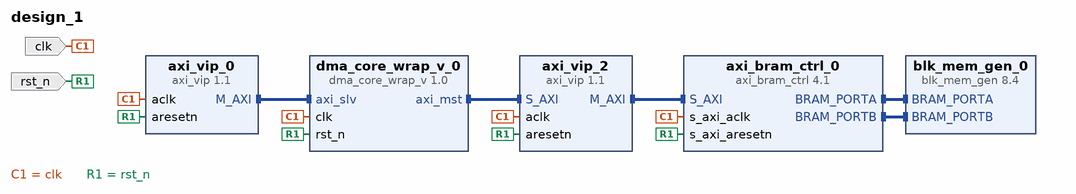
[diagram p0: block diagram of the top level]
# Vivado block design design_1, xczu19eg-ffvc1760-2-i, Vivado 2024.2
create_bd_design design_1

create_bd_port -dir I clk
create_bd_port -dir I rst_n

create_bd_cell -type ip -vlnv xilinx.com:ip:axi_vip:1.1 axi_vip_0
set_property -dict [list \
  CONFIG.ADDR_WIDTH 64 \
  CONFIG.ARUSER_WIDTH 0 \
  CONFIG.AWUSER_WIDTH 0 \
  CONFIG.BUSER_WIDTH 0 \
  CONFIG.DATA_WIDTH 64 \
  CONFIG.HAS_BRESP 1 \
  CONFIG.HAS_BURST 1 \
  CONFIG.HAS_CACHE 1 \
  CONFIG.HAS_LOCK 1 \
  CONFIG.HAS_PROT 1 \
  CONFIG.HAS_QOS 1 \
  CONFIG.HAS_REGION 1 \
  CONFIG.HAS_RRESP 1 \
  CONFIG.HAS_WSTRB 1 \
  CONFIG.ID_WIDTH 1 \
  CONFIG.INTERFACE_MODE MASTER \
  CONFIG.PROTOCOL AXI4 \
  CONFIG.READ_WRITE_MODE READ_WRITE \
  CONFIG.RUSER_WIDTH 0 \
  CONFIG.SUPPORTS_NARROW 1 \
  CONFIG.WUSER_WIDTH 0 \
] [get_bd_cells axi_vip_0]
create_bd_cell -type ip -vlnv user.org:user:dma_core_wrap_v:1.0 dma_core_wrap_v_0
set_property -dict [list \
  CONFIG.AxiIdWidth 0x00000008 \
  CONFIG.AxiSlvIdWidth 0x00000008 \
  CONFIG.FREQ_HZ 100000000 \
  CONFIG.JobFifoDepth 0x00000008 \
] [get_bd_cells dma_core_wrap_v_0]
create_bd_cell -type ip -vlnv xilinx.com:ip:axi_bram_ctrl:4.1 axi_bram_ctrl_0
set_property -dict {CONFIG.DATA_WIDTH 64} [get_bd_cells axi_bram_ctrl_0]
create_bd_cell -type ip -vlnv xilinx.com:ip:blk_mem_gen:8.4 blk_mem_gen_0
set_property -dict {CONFIG.Memory_Type True_Dual_Port_RAM} [get_bd_cells blk_mem_gen_0]
create_bd_cell -type ip -vlnv xilinx.com:ip:axi_vip:1.1 axi_vip_2

# ---- connections ----

connect_bd_intf_net [get_bd_intf_pins axi_bram_ctrl_0/BRAM_PORTA] [get_bd_intf_pins blk_mem_gen_0/BRAM_PORTA]
connect_bd_intf_net [get_bd_intf_pins axi_bram_ctrl_0/BRAM_PORTB] [get_bd_intf_pins blk_mem_gen_0/BRAM_PORTB]
connect_bd_intf_net [get_bd_intf_pins axi_vip_0/M_AXI] [get_bd_intf_pins dma_core_wrap_v_0/axi_slv]
connect_bd_intf_net [get_bd_intf_pins axi_vip_2/M_AXI] [get_bd_intf_pins axi_bram_ctrl_0/S_AXI]
connect_bd_intf_net [get_bd_intf_pins dma_core_wrap_v_0/axi_mst] [get_bd_intf_pins axi_vip_2/S_AXI]
connect_bd_net [get_bd_ports clk] \
  [get_bd_pins axi_vip_0/aclk] [get_bd_pins axi_vip_2/aclk] [get_bd_pins axi_bram_ctrl_0/s_axi_aclk] \
  [get_bd_pins dma_core_wrap_v_0/clk]
connect_bd_net [get_bd_ports rst_n] \
  [get_bd_pins axi_vip_0/aresetn] [get_bd_pins axi_vip_2/aresetn] [get_bd_pins axi_bram_ctrl_0/s_axi_aresetn] \
  [get_bd_pins dma_core_wrap_v_0/rst_n]

# ---- address map ----
assign_bd_address -offset 0x0000000044A00000 -range 64K -target_address_space [get_bd_addr_spaces axi_vip_0/Master_AXI] [get_bd_addr_segs dma_core_wrap_v_0/axi_slv/Reg]
exclude_bd_addr_seg -offset 0x00000000C0000000 -range 8K -target_address_space [get_bd_addr_spaces axi_vip_0/Master_AXI] [get_bd_addr_segs axi_bram_ctrl_0/S_AXI/Mem0]
assign_bd_address -offset 0x00000000C0000000 -range 8K -target_address_space [get_bd_addr_spaces dma_core_wrap_v_0/axi_mst] [get_bd_addr_segs axi_bram_ctrl_0/S_AXI/Mem0]

validate_bd_design
save_bd_design
